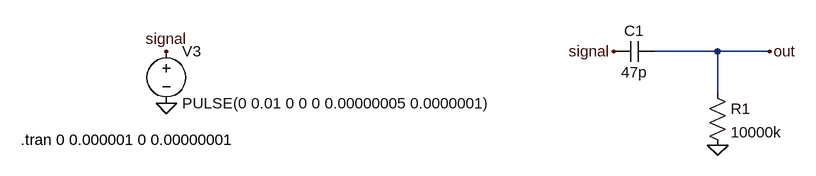
[diagram p0: schematic ac4.asc]
ac4.asc, the LTspice schematic file:
Version 4
SHEET 1 1180 680
WIRE 1024 144 928 144
WIRE 1104 144 1024 144
WIRE 1024 208 1024 144
FLAG 176 144 signal
FLAG 864 144 signal
FLAG 176 224 0
FLAG 1104 144 out
FLAG 1024 288 0
SYMBOL voltage 176 128 R0
WINDOW 123 0 0 Left 2
WINDOW 39 0 0 Left 2
SYMATTR InstName V3
SYMATTR Value PULSE(0 0.01 0 0 0 0.00000005 0.0000001)
SYMBOL cap 928 128 R90
WINDOW 0 0 32 VBottom 2
WINDOW 3 32 32 VTop 2
SYMATTR InstName C1
SYMATTR Value 47p
SYMBOL res 1008 192 R0
SYMATTR InstName R1
SYMATTR Value 10000k
TEXT -48 280 Left 2 !.tran 0 0.000001 0 0.00000001

The netlist it stands for:
* ac4.asc
V3 signal 0 PULSE(0 0.01 0 0 0 0.00000005 0.0000001)
C1 out signal 47p
R1 out 0 10000k
.tran 0 0.000001 0 0.00000001
.backanno
.end

* Results of the author's LTspice run, read from the files saved beside the schematic
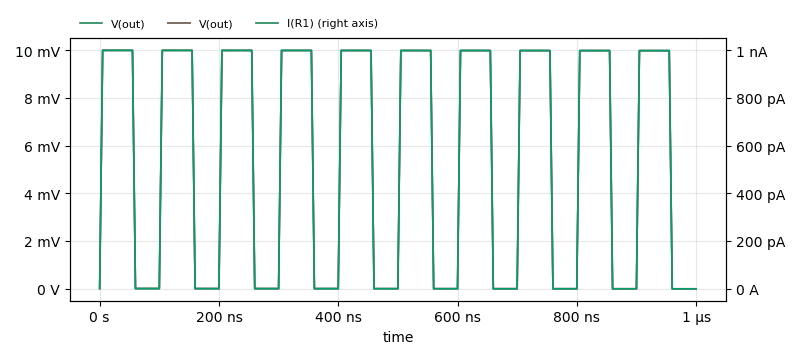
[diagram p1: Transient Analysis of ac4.asc, plotted from the saved traces]
* Transient Analysis, 1 run:
*   V(out): min -11.69 µV, max 10 mV, average 5.494 mV, rms 7.412 mV, last -11.69 µV
*   V(out): min -11.69 µV, max 10 mV, average 5.494 mV, rms 7.412 mV, last -11.69 µV
*   I(R1): min -1.169 pA, max 1 nA, average 549.4 pA, rms 741.2 pA, last -1.169 pA